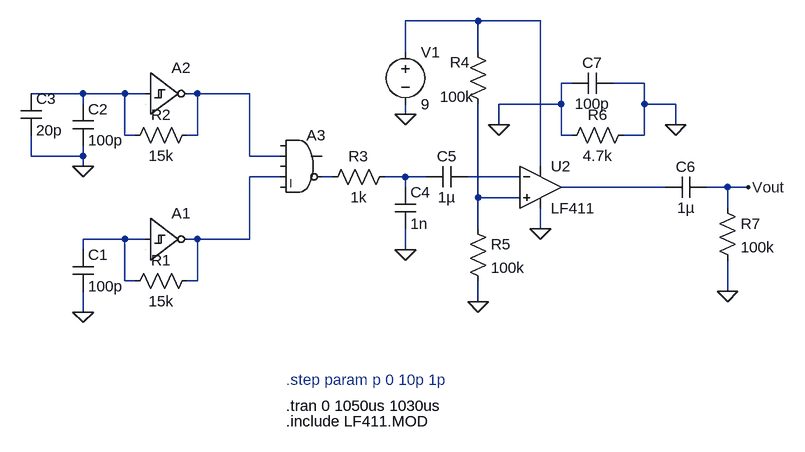
[diagram p0: schematic draft2.asc]
draft2.asc, the LTspice schematic file:
Version 4
SHEET 1 1340 756
WIRE 624 -112 512 -112
WIRE 720 -112 624 -112
WIRE 512 -64 512 -112
WIRE 624 -64 624 -112
WIRE 768 -16 752 -16
WIRE 880 -16 832 -16
WIRE 16 0 -64 0
WIRE 80 0 16 0
WIRE 112 0 80 0
WIRE 192 0 176 0
WIRE 272 0 192 0
WIRE 16 16 16 0
WIRE 752 16 752 -16
WIRE 752 16 656 16
WIRE 880 16 880 -16
WIRE 928 16 880 16
WIRE 512 32 512 16
WIRE 656 48 656 16
WIRE 928 48 928 16
WIRE 80 64 80 0
WIRE 96 64 80 64
WIRE 192 64 192 0
WIRE 192 64 176 64
WIRE 752 64 752 16
WIRE 768 64 752 64
WIRE 880 64 880 16
WIRE 880 64 848 64
WIRE -64 96 -64 64
WIRE 16 96 16 80
WIRE 16 96 -64 96
WIRE 272 96 272 0
WIRE 320 96 272 96
WIRE 16 112 16 96
WIRE 720 112 720 -112
WIRE 320 128 272 128
WIRE 400 128 384 128
WIRE 512 128 480 128
WIRE 544 128 512 128
WIRE 688 128 608 128
WIRE 512 144 512 128
WIRE 912 144 752 144
WIRE 1008 144 976 144
WIRE 1040 144 1008 144
WIRE 624 160 624 16
WIRE 688 160 624 160
WIRE 1008 176 1008 144
WIRE 624 208 624 160
WIRE 720 208 720 176
WIRE 80 224 16 224
WIRE 112 224 80 224
WIRE 192 224 176 224
WIRE 272 224 272 128
WIRE 272 224 192 224
WIRE 16 240 16 224
WIRE 512 240 512 208
WIRE 80 288 80 224
WIRE 96 288 80 288
WIRE 192 288 192 224
WIRE 192 288 176 288
WIRE 1008 304 1008 256
WIRE 624 320 624 288
WIRE 16 336 16 304
FLAG 16 336 0
FLAG 16 112 0
FLAG 512 240 0
FLAG 512 32 0
FLAG 624 320 0
FLAG 1040 144 Vout
FLAG 720 208 0
FLAG 656 48 0
FLAG 1008 304 0
FLAG 928 48 0
SYMBOL Digital\\schmtinv 112 160 R0
WINDOW 3 -71 111 Invisible 0
SYMATTR Value Vhigh=9, Vt=4.5, Vh=0.3, trise=20n, tfall=20n
SYMATTR InstName A1
SYMBOL res 192 272 R90
WINDOW 0 0 56 VBottom 0
WINDOW 3 32 56 VTop 0
SYMATTR InstName R1
SYMATTR Value 15k
SYMBOL cap 0 240 R0
SYMATTR InstName C1
SYMATTR Value 100p
SYMBOL Digital\\schmtinv 112 -64 R0
WINDOW 3 -71 111 Invisible 0
SYMATTR Value Vhigh=9, Vt=4.5, Vh=0.3, trise=20n, tfall=20n
SYMATTR InstName A2
SYMBOL res 192 48 R90
WINDOW 0 0 56 VBottom 0
WINDOW 3 32 56 VTop 0
SYMATTR InstName R2
SYMATTR Value 15k
SYMBOL cap 0 16 R0
SYMATTR InstName C2
SYMATTR Value 100p
SYMBOL cap -80 0 R0
SYMATTR InstName C3
SYMATTR Value 20p
SYMBOL Digital\\and 352 48 R0
WINDOW 3 16 52 Invisible 0
SYMATTR Value trise=20n, tfall=20n, Vt=4.5, Vhigh=9
SYMATTR InstName A3
SYMBOL res 496 112 R90
WINDOW 0 0 56 VBottom 0
WINDOW 3 32 56 VTop 0
SYMATTR InstName R3
SYMATTR Value 1k
SYMBOL cap 496 144 R0
SYMATTR InstName C4
SYMATTR Value 1n
SYMBOL cap 608 112 R90
WINDOW 0 0 32 VBottom 0
WINDOW 3 32 32 VTop 0
SYMATTR InstName C5
SYMATTR Value 1µ
SYMBOL cap 976 128 R90
WINDOW 0 0 32 VBottom 0
WINDOW 3 32 32 VTop 0
SYMATTR InstName C6
SYMATTR Value 1µ
SYMBOL cap 832 -32 R90
WINDOW 0 0 32 VBottom 0
WINDOW 3 32 32 VTop 0
SYMATTR InstName C7
SYMATTR Value 100p
SYMBOL voltage 512 -80 R0
WINDOW 123 0 0 Left 0
WINDOW 39 0 0 Left 0
SYMATTR InstName V1
SYMATTR Value 9
SYMBOL res 608 -80 R0
WINDOW 0 -27 32 Left 0
WINDOW 3 -43 85 Left 0
SYMATTR InstName R4
SYMATTR Value 100k
SYMBOL res 608 192 R0
SYMATTR InstName R5
SYMATTR Value 100k
SYMBOL res 864 48 R90
WINDOW 0 0 56 VBottom 0
WINDOW 3 32 56 VTop 0
SYMATTR InstName R6
SYMATTR Value 4.7k
SYMBOL Opamps\\opamp2 720 80 R0
SYMATTR InstName U2
SYMATTR Value LF411
SYMBOL res 992 160 R0
SYMATTR InstName R7
SYMATTR Value 100k
TEXT 328 480 Left 0 !.tran 0 1050us 1030us
TEXT 328 440 Left 0 ;.step param p 0 10p 1p
TEXT 328 504 Left 0 !.include LF411.MOD

The netlist it stands for:
* draft2.asc
A1 N010 0 0 0 0 N004 0 0 SCHMITT Vhigh=9, Vt=4.5, Vh=0.3, trise=20n, tfall=20n
R1 N004 N010 15k
C1 N010 0 100p
A2 N002 0 0 0 0 N003 0 0 SCHMITT Vhigh=9, Vt=4.5, Vh=0.3, trise=20n, tfall=20n
R2 N003 N002 15k
C2 N002 0 100p
C3 N002 0 20p
A3 0 N003 0 N004 0 N005 0 0 AND trise=20n, tfall=20n, Vt=4.5, Vhigh=9
R3 N006 N005 1k
C4 N006 0 1n
C5 N007 N006 1µ
C6 Vout N008 1µ
C7 0 0 100p
V1 N001 0 9
R4 N001 N009 100k
R5 N009 0 100k
R6 0 0 4.7k
XU2 N009 N007 N001 0 N008 LF411  ; pins In+ In- V+ V- OUT
R7 Vout 0 100k
.tran 0 1050us 1030us
* .step param p 0 10p 1p
.include LF411.MOD
.backanno
.end